# EAGLE design SEGmeter25 (EAGLE 6.2)
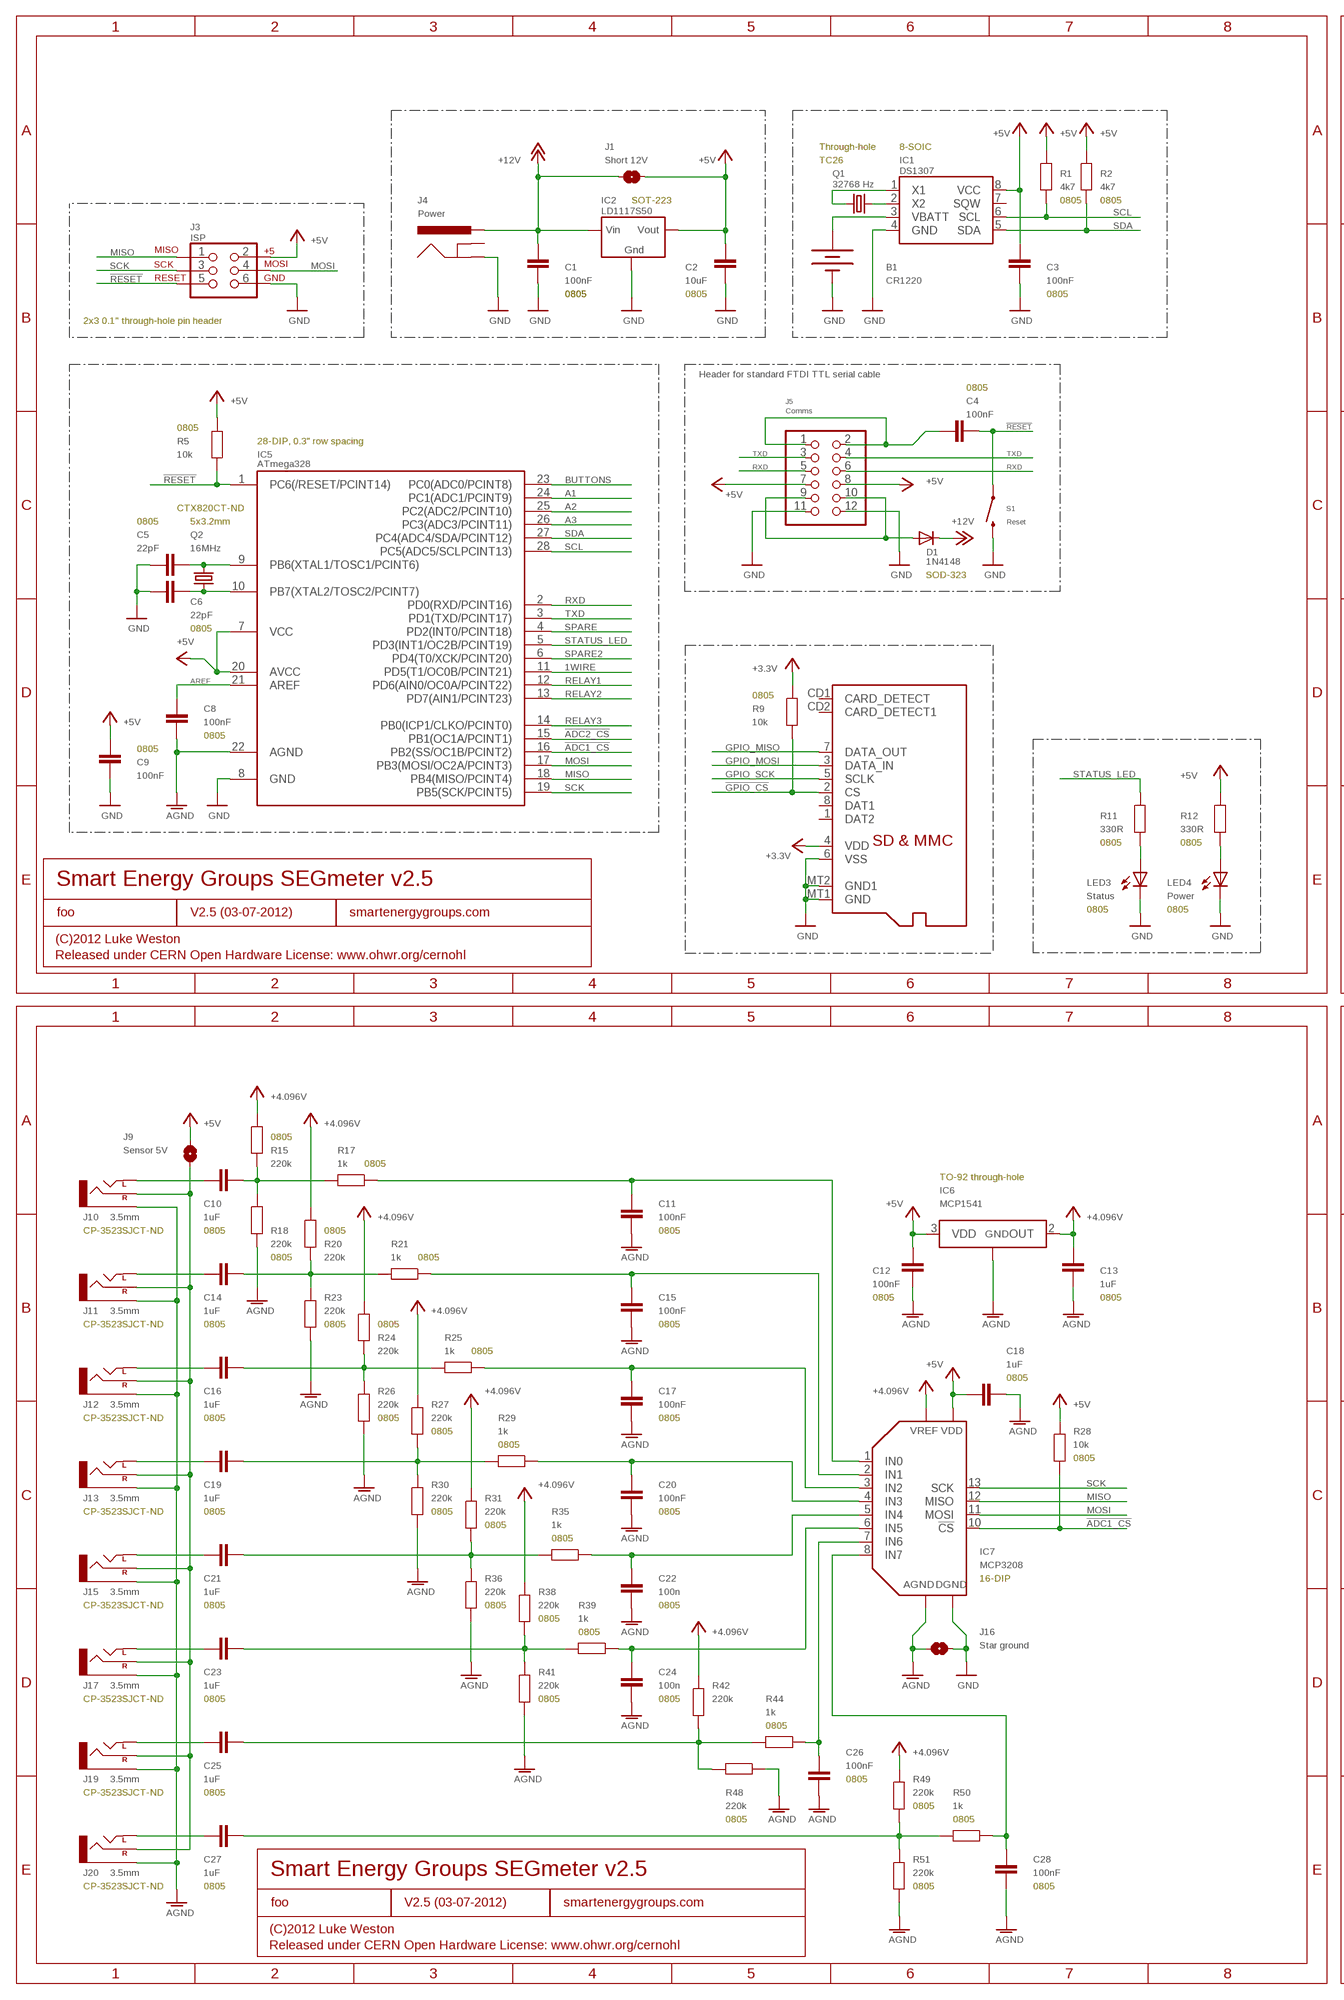
[diagram p0: schematic, sheet 1, part 1 of 2]
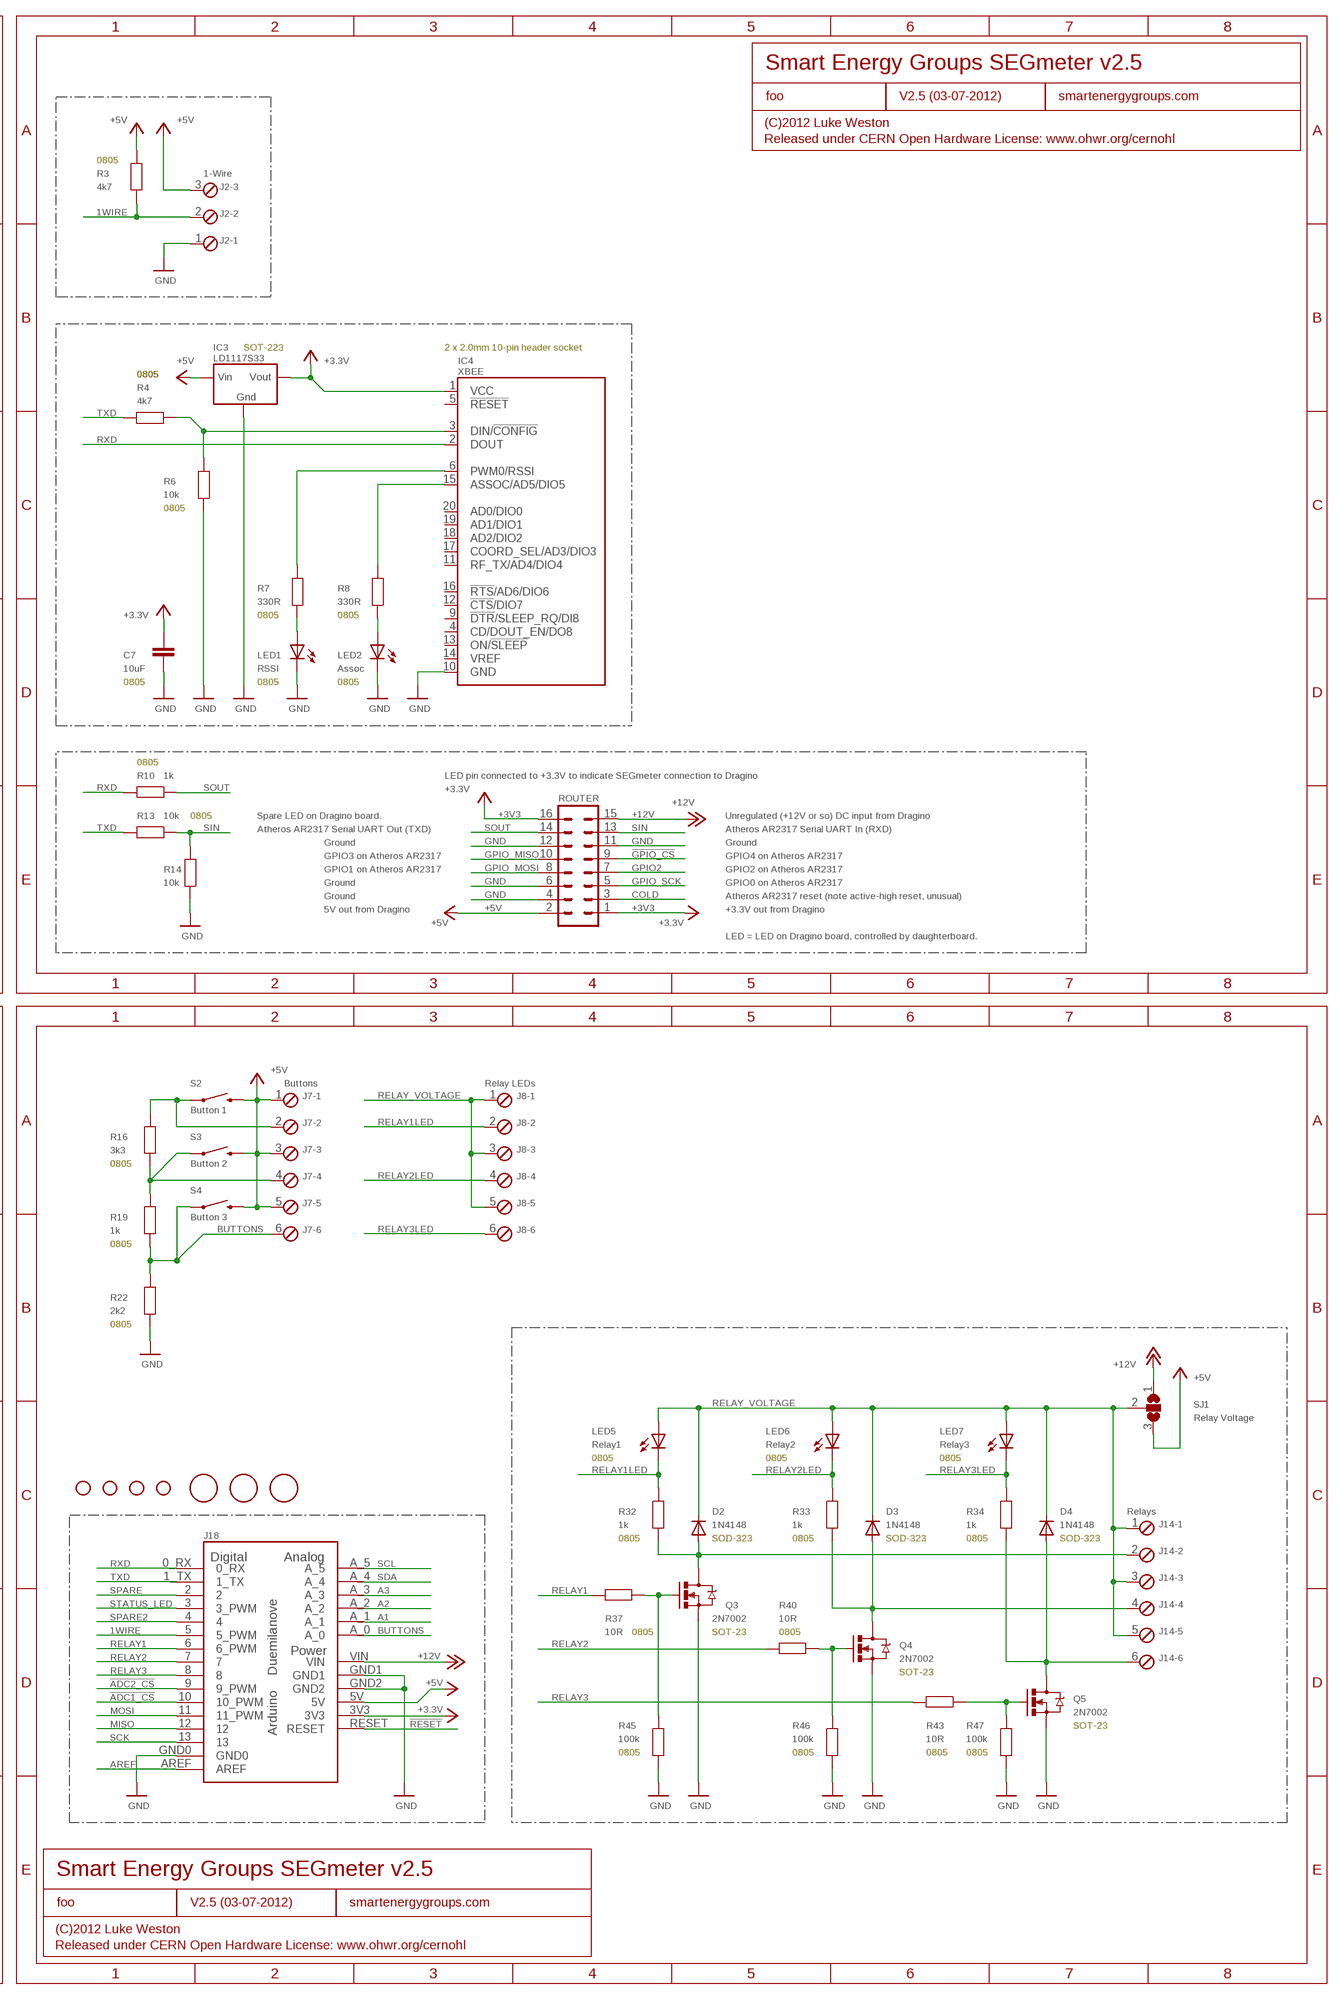
[diagram p1: schematic, sheet 1, part 2 of 2]

## Parts
B1  CR1220  BATTERY12MM  [BATTCON_12MM]
C1  100nF  CAP0805  [0805]
C2  10uF  CAP0805  [0805]
C3  100nF  CAP0805  [0805]
C4  100nF  CAP0805  [0805]
C5  22pF  CAP0805  [0805]
C6  22pF  CAP0805  [0805]
C7  10uF  CAP0805  [0805]
C8  100nF  CAP0805  [0805]
C9  100nF  CAP0805  [0805]
C10  1uF  CAP0805  [0805]
C11  100nF  CAP0805  [0805]
C12  100nF  CAP0805  [0805]
C13  1uF  CAP0805  [0805]
C14  1uF  CAP0805  [0805]
C15  100nF  CAP0805  [0805]
C16  1uF  CAP0805  [0805]
C17  100nF  CAP0805  [0805]
C18  1uF  CAP0805  [0805]
C19  1uF  CAP0805  [0805]
C20  100nF  CAP0805  [0805]
C21  1uF  CAP0805  [0805]
C22  100n  CAP0805  [0805]
C23  1uF  CAP0805  [0805]
C24  100n  CAP0805  [0805]
C25  1uF  CAP0805  [0805]
C26  100nF  CAP0805  [0805]
C27  1uF  CAP0805  [0805]
C28  100nF  CAP0805  [0805]
D1  1N4148  DIODESOD  [SOD-323]
D2  1N4148  DIODESOD  [SOD-323]
D3  1N4148  DIODESOD  [SOD-323]
D4  1N4148  DIODESOD  [SOD-323]
FID1  FIDUCIAL  [FIDUCIAL_1MM]
FID2  FIDUCIAL  [FIDUCIAL_1MM]
FID3  FIDUCIAL  [FIDUCIAL_1MM]
H1  STAND-OFF  [STAND-OFF]
H2  STAND-OFF  [STAND-OFF]
H3  STAND-OFF  [STAND-OFF]
H4  STAND-OFF  [STAND-OFF]
IC1  DS1307  DS1307SO8  [SO08]
IC2  LD1117S50  REG1117  [SOT223]
IC3  LD1117S33  REG1117  [SOT223]
IC4  XBEE  [XBEE-PRO]
IC5  ATmega328  MEGA48/88/168-PU  [DIL28-3]
IC6  MCP1541  [TO92-STRAIGHT]
IC7  MCP3208  MCP3208DIL  [DIL16]
J1  Short 12V  SJ  [SJ]
J2  1-Wire  MPT3  [3POL254]
J3  ISP  AVR_SPI_PRG_6NS  [2X3-NS]
J4  Power  POWER_JACKSLT  [POWER_JACK_SLOT]
J5  Comms  PINHD-2X6  [2X06]
J6  MICROSD  [MICROSD]
J7  Buttons  MPT6  [6POL254]
J8  Relay LEDs  MPT6  [6POL254]
J9  Sensor 5V  SJ  [SJ]
J10  3.5mm  AUDIO-JACKSMD2  [AUDIO-JACK-3.5MM-SMD]
J11  3.5mm  AUDIO-JACKSMD2  [AUDIO-JACK-3.5MM-SMD]
J12  3.5mm  AUDIO-JACKSMD2  [AUDIO-JACK-3.5MM-SMD]
J13  3.5mm  AUDIO-JACKSMD2  [AUDIO-JACK-3.5MM-SMD]
J14  Relays  MPT6  [6POL254]
J15  3.5mm  AUDIO-JACKSMD2  [AUDIO-JACK-3.5MM-SMD]
J16  Star ground  SJ  [SJ]
J17  3.5mm  AUDIO-JACKSMD2  [AUDIO-JACK-3.5MM-SMD]
J18  Arduino-compatible headers  ARDUINO-USBNO-OUTLINE-NO-TEXT-OCTAGONAL  [NO-OUTLINE-OCTAGONAL-NOTEXT]
J19  3.5mm  AUDIO-JACKSMD2  [AUDIO-JACK-3.5MM-SMD]
J20  3.5mm  AUDIO-JACKSMD2  [AUDIO-JACK-3.5MM-SMD]
LED1  RSSI  LED0805  [LED-0805]
LED2  Assoc  LED0805  [LED-0805]
LED3  Status  LED0805  [LED-0805]
LED4  Power  LED0805  [LED-0805]
LED5  Relay1  LED0805  [LED-0805]
LED6  Relay2  LED0805  [LED-0805]
LED7  Relay3  LED0805  [LED-0805]
Q1  32768 Hz  CRYSTAL32-SMD  [CRYSTAL-32KHZ-SMD]
Q2  16MHz  CRYSTAL5X3  [CRYSTAL-SMD-5X3]
Q3  2N7002  [SOT23-3]
Q4  2N7002  [SOT23-3]
Q5  2N7002  [SOT23-3]
R1  4k7  RESISTOR0805  [0805]
R2  4k7  RESISTOR0805  [0805]
R3  4k7  RESISTOR0805  [0805]
R4  4k7  RESISTOR0805  [0805]
R5  10k  RESISTOR0805  [0805]
R6  10k  RESISTOR0805  [0805]
R7  330R  RESISTOR0805  [0805]
R8  330R  RESISTOR0805  [0805]
R9  10k  RESISTOR0805  [0805]
R10  1k  RESISTOR0805  [0805]
R11  330R  RESISTOR0805  [0805]
R12  330R  RESISTOR0805  [0805]
R13  10k  RESISTOR0805  [0805]
R14  10k  RESISTOR0805  [0805]
R15  220k  RESISTOR0805  [0805]
R16  3k3  RESISTOR0805  [0805]
R17  1k  RESISTOR0805  [0805]
R18  220k  RESISTOR0805  [0805]
R19  1k  RESISTOR0805  [0805]
R20  220k  RESISTOR0805  [0805]
R21  1k  RESISTOR0805  [0805]
R22  2k2  RESISTOR0805  [0805]
R23  220k  RESISTOR0805  [0805]
R24  220k  RESISTOR0805  [0805]
R25  1k  RESISTOR0805  [0805]
R26  220k  RESISTOR0805  [0805]
R27  220k  RESISTOR0805  [0805]
R28  10k  RESISTOR0805  [0805]
R29  1k  RESISTOR0805  [0805]
R30  220k  RESISTOR0805  [0805]
R31  220k  RESISTOR0805  [0805]
R32  1k  RESISTOR0805  [0805]
R33  1k  RESISTOR0805  [0805]
R34  1k  RESISTOR0805  [0805]
R35  1k  RESISTOR0805  [0805]
R36  220k  RESISTOR0805  [0805]
R37  10R  RESISTOR0805  [0805]
R38  220k  RESISTOR0805  [0805]
R39  1k  RESISTOR0805  [0805]
R40  10R  RESISTOR0805  [0805]
R41  220k  RESISTOR0805  [0805]
R42  220k  RESISTOR0805  [0805]
R43  10R  RESISTOR0805  [0805]
R44  1k  RESISTOR0805  [0805]
R45  100k  RESISTOR0805  [0805]
R46  100k  RESISTOR0805  [0805]
R47  100k  RESISTOR0805  [0805]
R48  220k  RESISTOR0805  [0805]
R49  220k  RESISTOR0805  [0805]
R50  1k  RESISTOR0805  [0805]
R51  220k  RESISTOR0805  [0805]
ROUTER  MA08-2  [MA08-2]
S1  Reset  SWITCH-MOMENTARY-2SMD  [TACTILE_SWITCH_SMD]
S2  Button 1  SWITCH-MOMENTARY-2SMD  [TACTILE_SWITCH_SMD]
S3  Button 2  SWITCH-MOMENTARY-2SMD  [TACTILE_SWITCH_SMD]
S4  Button 3  SWITCH-MOMENTARY-2SMD  [TACTILE_SWITCH_SMD]
SJ1  Relay Voltage  SJ2W  [SJ_2]

## Nets
1WIRE: IC5.11(PD5(T1/OC0B/PCINT21)) J2.2 J18.5(5_PWM) R3.1
3.3VTXD: IC4.3(DIN/!CONFIG) R4.2 R6.1
!ADC1_CS: IC5.16(PB2(SS/OC1B/PCINT2)) IC7.10(!CS) J18.10(10_PWM) R28.1
!ADC2_CS: IC5.15(PB1(OC1A/PCINT1)) J18.9(9_PWM)
!GPIO_CS: J6.2(CS) R9.1 ROUTER.9
!RESET: C4.1 IC5.1(PC6(/RESET/PCINT14)) J3.5 J18.RESET R5.2 S1.1
+3V3: C7.2 IC3.2(VOUT) IC4.1(VCC) J6.4(VDD) J18.3V3 R9.2 ROUTER.1 ROUTER.16 ; supply symbol labelled +3.3V
+5V: C2.2 C3.2 C9.2 C12.2 C18.2 IC1.8(VCC) IC2.2(VOUT) IC3.3(VIN) IC5.7(VCC) IC5.20(AVCC) IC6.3(VDD) IC7.16(VDD) J1.2 J2.3 J3.2 J5.7 J5.8 J7.1 J7.3 J7.5 J9.2 J18.5V R1.2 R2.2 R3.2 R5.1 R12.2 R28.2 ROUTER.2 S2.3 S3.3 S4.3 SJ1.3
+12V: C1.2 D1.1(C) IC2.3(VIN) J1.1 J4.PWR J18.VIN ROUTER.15 SJ1.1
A1: IC5.24(PC1(ADC1/PCINT9)) J18.A_1
A2: IC5.25(PC2(ADC2/PCINT10)) J18.A_2
A3: IC5.26(PC3(ADC3/PCINT11)) J18.A_3
AGND: C8.1 C11.1 C12.1 C13.1 C15.1 C17.1 C18.1 C20.1 C22.1 C24.1 C26.1 C28.1 IC5.22(AGND) IC6.1(GND) IC7.14(AGND) J10.SLEEVE J11.SLEEVE J12.SLEEVE J13.SLEEVE J15.SLEEVE J16.2 J17.SLEEVE J19.SLEEVE J20.SLEEVE R18.1 R23.1 R26.1 R30.1 R36.1 R41.1 R48.1 R51.1
AREF: C8.2 IC5.21(AREF) J18.AREF
BUTTON1: J7.2 R16.2 S2.1
BUTTON2: J7.4 R16.1 R19.2 S3.1
BUTTONS: IC5.23(PC0(ADC0/PCINT8)) J7.6 J18.A_0 R19.1 R22.2 S4.1
COLD: ROUTER.3
GND: B1.GND(-) C1.1 C2.1 C3.1 C5.2 C6.2 C7.1 C9.1 IC1.4(GND) IC2.1(GND) IC3.1(GND) IC4.10(GND) IC5.8(GND) IC7.9(DGND) J2.1 J3.6 J4.GND J5.11 J5.12 J6.6(VSS) J6.MT1(GND) J6.MT2(GND1) J16.1 J18.GND0 J18.GND1 J18.GND2 LED1.C LED2.C LED3.C LED4.C Q3.2(S) Q4.2(S) Q5.2(S) R6.2 R14.2 R22.1 R45.1 R46.1 R47.1 ROUTER.4 ROUTER.6 ROUTER.11 ROUTER.12 S1.3
GPIO2: ROUTER.7
GPIO_MISO: J6.7(DATA_OUT) ROUTER.10
GPIO_MOSI: J6.3(DATA_IN) ROUTER.8
GPIO_SCK: J6.5(SCLK) ROUTER.5
MISO: IC5.18(PB4(MISO/PCINT4)) IC7.12(MISO) J3.1 J18.12
MOSI: IC5.17(PB3(MOSI/OC2A/PCINT3)) IC7.11(MOSI) J3.4 J18.11(11_PWM)
N$1: LED4.A R12.1
N$2: LED3.A R11.1
N$3: D1.2(A) J5.9 J5.10
N$4: IC4.6(PWM0/RSSI) R7.1
N$5: IC4.15(ASSOC/AD5/DIO5) R8.1
N$6: LED2.A R8.2
N$7: LED1.A R7.2
N$8: IC1.2(X2) Q1.X2
N$9: B1.PWR@1(+) IC1.3(VBATT)
N$12: IC1.1(X1) Q1.X1
N$18: D2.2(A) J14.2 Q3.3(D) R32.1
N$26: D3.2(A) J14.4 Q4.3(D) R33.1
N$28: C5.1 IC5.9(PB6(XTAL1/TOSC1/PCINT6)) Q2.1
N$29: C6.1 IC5.10(PB7(XTAL2/TOSC2/PCINT7)) Q2.3
N$30: C27.1 J20.TIP(LEFT)
N$40: D4.2(A) J14.6 Q5.3(D) R34.1
N$41: C25.1 J19.TIP(LEFT)
N$42: C10.1 J10.TIP(LEFT)
N$43: C4.2 J5.1 J5.2
N$44: C14.1 J11.TIP(LEFT)
N$45: C23.1 J17.TIP(LEFT)
N$46: J9.1 J10.RING(RIGHT) J11.RING(RIGHT) J12.RING(RIGHT) J13.RING(RIGHT) J15.RING(RIGHT) J17.RING(RIGHT) J19.RING(RIGHT) J20.RING(RIGHT)
N$47: C21.1 J15.TIP(LEFT)
N$48: C19.1 J13.TIP(LEFT)
N$49: C16.1 J12.TIP(LEFT)
N$50: C10.2 R15.1 R17.2 R18.2
N$51: C27.2 R49.1 R50.2 R51.2
N$52: C25.2 R42.1 R44.2 R48.2
N$53: C23.2 R38.1 R39.2 R41.2
N$54: C21.2 R31.1 R35.2 R36.2
N$55: C14.2 R20.1 R21.2 R23.2
N$56: C16.2 R24.1 R25.2 R26.2
N$57: C19.2 R27.1 R29.2 R30.2
N$59: C26.2 IC7.7(IN6) R44.1
N$60: C15.2 IC7.2(IN1) R21.1
N$62: C17.2 IC7.3(IN2) R25.1
N$63: C20.2 IC7.4(IN3) R29.1
N$64: C22.2 IC7.5(IN4) R35.1
N$65: C28.2 IC7.8(IN7) R50.1
N$66: Q5.1(G) R43.1 R47.2
N$67: C24.2 IC7.6(IN5) R39.1
N$68: Q3.1(G) R37.1 R45.2
N$69: Q4.1(G) R40.1 R46.2
N$70: C11.2 IC7.1(IN0) R17.1
RELAY1: IC5.12(PD6(AIN0/OC0A/PCINT22)) J18.6(6_PWM) R37.2
RELAY1LED: J8.2 LED5.C R32.2
RELAY2: IC5.13(PD7(AIN1/PCINT23)) J18.7 R40.2
RELAY2LED: J8.4 LED6.C R33.2
RELAY3: IC5.14(PB0(ICP1/CLKO/PCINT0)) J18.8 R43.2
RELAY3LED: J8.6 LED7.C R34.2
RELAY_VOLTAGE: D2.1(C) D3.1(C) D4.1(C) J8.1 J8.3 J8.5 J14.1 J14.3 J14.5 LED5.A LED6.A LED7.A SJ1.2
RXD: IC4.2(DOUT) IC5.2(PD0(RXD/PCINT16)) J5.5 J5.6 J18.0_RX R10.2
SCK: IC5.19(PB5(SCK/PCINT5)) IC7.13(SCK) J3.3 J18.13
SCL: IC1.6(SCL) IC5.28(PC5(ADC5/SCLPCINT13)) J18.A_5 R1.1
SDA: IC1.5(SDA) IC5.27(PC4(ADC4/SDA/PCINT12)) J18.A_4 R2.1
SIN: R13.1 R14.1 ROUTER.13
SOUT: R10.1 ROUTER.14
SPARE: IC5.4(PD2(INT0/PCINT18)) J18.2
SPARE2: IC5.6(PD4(T0/XCK/PCINT20)) J18.4
STATUS_LED: IC5.5(PD3(INT1/OC2B/PCINT19)) J18.3(3_PWM) R11.2
TXD: IC5.3(PD1(TXD/PCINT17)) J5.3 J5.4 J18.1_TX R4.1 R13.2
V+: C13.2 IC6.2(OUT) IC7.15(VREF) R15.2 R20.2 R24.2 R27.2 R31.2 R38.2 R42.2 R49.2 ; supply symbol labelled +4.096V
Unconnected: IC1.7(SQW) IC4.4(CD/DOUT_EN/DO8) IC4.5(!RESET) IC4.9(!DTR!/SLEEP_RQ/DI8) IC4.11(RF_TX/AD4/DIO4) IC4.12(!CTS!/DIO7) IC4.13(ON/!SLEEP) IC4.14(VREF) IC4.16(!RTS!/AD6/DIO6) IC4.17(COORD_SEL/AD3/DIO3) IC4.18(AD2/DIO2) IC4.19(AD1/DIO1) IC4.20(AD0/DIO0) J4.SW(GNDBREAK) J6.1(DAT2) J6.8(DAT1) J6.CD1(CARD_DETECT) J6.CD2(CARD_DETECT1)

## Notes on the sheet
- Smart Energy Groups SEGmeter v2.5
- foo | V2.5 (03-07-2012) | smartenergygroups.com
- (C)2012 Luke Weston
- Released under CERN Open Hardware License: www.ohwr.org/cernohl
- Through-hole | 8-SOIC
- TC26 | 0805
- SOT-223 | 0805 | 0805
- 0805 | 0805 | 0805 | 0805
- 2x3 0.1" through-hole pin header
- SOT-223 | 2 x 2.0mm 10-pin header socket
- Header for standard FTDI TTL serial cable | 0805 | 0805
- 0805
- 0805
- 28-DIP, 0.3" row spacing
- CTX820CT-ND | 0805
- 0805 | 5x3.2mm
- SOD-323
- 0805 | 0805
- 0805
- 0805 | 0805 | 0805
- 0805
- 0805
- 0805
- 0805
- LED pin connected to +3.3V to indicate SEGmeter connection to Dragino
- 0805 | Spare LED on Dragino board. | Unregulated (+12V or so) DC input from Dragino
- Atheros AR2317 Serial UART Out (TXD) | Atheros AR2317 Serial UART In (RXD)
- 0805 | 0805 | Ground | Ground
- GPIO3 on Atheros AR2317 | GPIO4 on Atheros AR2317
- GPIO1 on Atheros AR2317 | GPIO2 on Atheros AR2317
- Smart Energy Groups SEGmeter v2.5 | Ground | GPIO0 on Atheros AR2317
- Ground | Atheros AR2317 reset (note active-high reset, unusual)
- 0805 | 0805 | 5V out from Dragino | +3.3V out from Dragino
- foo | V2.5 (03-07-2012) | smartenergygroups.com
- LED = LED on Dragino board, controlled by daughterboard.
- (C)2012 Luke Weston
- Released under CERN Open Hardware License: www.ohwr.org/cernohl
- 0805
- 0805 | 0805
- TO-92 through-hole
- CP-3523SJCT-ND | 0805 | 0805 | 0805
- 0805
- 0805 | 0805
- 0805 | 0805
- CP-3523SJCT-ND | 0805 | 0805 | 0805 | 0805 | 0805
- 0805
- 0805
- CP-3523SJCT-ND | 0805 | 0805 | 0805
- 0805
- 0805
- 0805 | 0805 | 0805 | 0805
- CP-3523SJCT-ND | 0805 | 0805 | 0805
- 0805
- 0805 | 0805 | SOD-323 | 0805 | SOD-323 | 0805 | SOD-323
- 16-DIP
- CP-3523SJCT-ND | 0805 | 0805 | 0805
- 0805
- 0805 | 0805 | SOT-23 | 0805
- SOT-23
- CP-3523SJCT-ND | 0805 | 0805 | 0805
- 0805 | SOT-23
- 0805 | 0805 | 0805 | 0805
- 0805
- CP-3523SJCT-ND | 0805
- 0805
- 0805 | 0805
- Smart Energy Groups SEGmeter v2.5 | Smart Energy Groups SEGmeter v2.5
- CP-3523SJCT-ND | 0805 | 0805 | 0805
- foo | V2.5 (03-07-2012) | smartenergygroups.com | foo | V2.5 (03-07-2012) | smartenergygroups.com
- (C)2012 Luke Weston | (C)2012 Luke Weston
- Released under CERN Open Hardware License: www.ohwr.org/cernohl | Released under CERN Open Hardware License: www.ohwr.org/cernohl

## Library data of the parts
B1 = SparkFun:BATTERY: Battery Holders Various common sizes : AA, AAA, 20mm coin cell and 12mm coin cell.
C1-C28 = freetronics-master-v1:CAP: Capacitor Standard 0603 ceramic capacitor, and 0.1" leaded capacitor.
D1-D4 = SparkFun:DIODE: Diode These are standard reverse protection diodes and small signal diodes. SMA package can handle up to about 1A. SOD-323 can handle about 200mA. What the SOD-323 package when ordering, there are some mfgs out there that are 5-pin packages.
FID1-FID3 = adafruit:FIDUCIAL: For use by pick and place machines to calibrate the vision/machine, 1mm By microbuilder.eu
H1-H4 = SparkFun:STAND-OFF: Stand Off This is the mechanical footprint for a #4 phillips button head screw. Use the keepout ring to avoid running the screw head into surrounding components. SKU : PRT-00447
IC1 = SparkFun:DS1307
IC2 IC3 = burr-brown:REG1117: 800mA and 1A Low Dropout (LDO) Positive Regulator 1.8V, 2.5V, 2.85V, 3.3V, 5V, and Adj; MPN: REG1117; OC_FARNELL: 1097566; OC_NEWARK: 14P6981
IC4 = Luke:XBEE
IC5 = avr-5:MEGA48/88/168-PU
IC6 = freetronics-luke:MCP1541: Microchip MCP1541 4.096V voltage reference.
IC7 = Luke:MCP3208
J1 J9 J16 = freetronics-luke:SJ: PCB "solder jumper". Note that there should nothing on the BOM corresponding to this "component".
J2 = con-phoenix-254:MPT3: PHOENIX CONNECTOR; OC_FARNELL: unknown; OC_NEWARK: unknown
J3 = SparkFun:AVR_SPI_PRG_6: AVR ISP 6 Pin This is the reduced ISP connector for AVR programming. Common on Arduino. This footprint will take up less PCB space and can be used with a 10-pin to 6-pin adapter such as SKU: BOB-08508
J4 = SparkFun:POWER_JACK: Power Jack This is the standard 5.5mm barrel jack for power. The PTH is the most common, proven, reliable, footprint. All others are experimental. The Slot footprint only works if the mill layer is transmitted to the PCB fab house so be warned. Spark Fun Electronics SKU : PRT-00119. Mating wall wart : TOL-00298 (and others)
J5 = pinhead:PINHD-2X6: PIN HEADER
J6 = adafruit:MICROSD: Micro-SD / Transflash card holder with SPI pinout For the 3M # 2908-05WB-MG and/or 4UCON #19656 push-push type
J7 J8 J14 = con-phoenix-254:MPT6: PHOENIX CONNECTOR; OC_FARNELL: unknown; OC_NEWARK: unknown
J10-J13 J15 J17 J19 J20 = SparkFun:AUDIO-JACK: 3.5mm Audio Jack Simple 3.5mm common PCB mount audio jack. SKU: PRT-08032
J18 = Arduino-Various:ARDUINO-USB: The Ardiuno Duemilanove Pinouts layoutet as a Bare Shield. v0.5 Also for Arduino Diecimila. This is designed as a Part and has no Outline in the Dimension Layer. The Outline, when present, is drawed at the tPlace / bPlace Layer. Library by Stephanie Lange, http://www.k-ita.de/~sl/
LED1-LED7 = freetronics-master-v1:LED: LEDs Standard schematic elements and footprints for 5mm, 3mm, 1206, and 0603 sized LEDs. 5mm - Spark Fun Electronics SKU : COM-00529 (and others)
Q1 Q2 = SparkFun:CRYSTAL: Crystals Various standard crystals. Proven footprints. Spark Fun Electronics SKU : COM-00534
Q3-Q5 = freetronics-luke:2N7002: 2N7002 N-ch MOSFET in SOT-23.
R1-R51 = freetronics-master-v1:RESISTOR: Resistor Basic schematic elements and footprints for 0603, 1206, and PTH 1/10th watt (small) resistors.
ROUTER = con-lstb:MA08-2: PIN HEADER; OC_FARNELL: unknown; OC_NEWARK: unknown
S1-S4 = SparkFun:SWITCH-MOMENTARY-2
SJ1 = jumper:SJ2W: SMD solder JUMPER

## Board
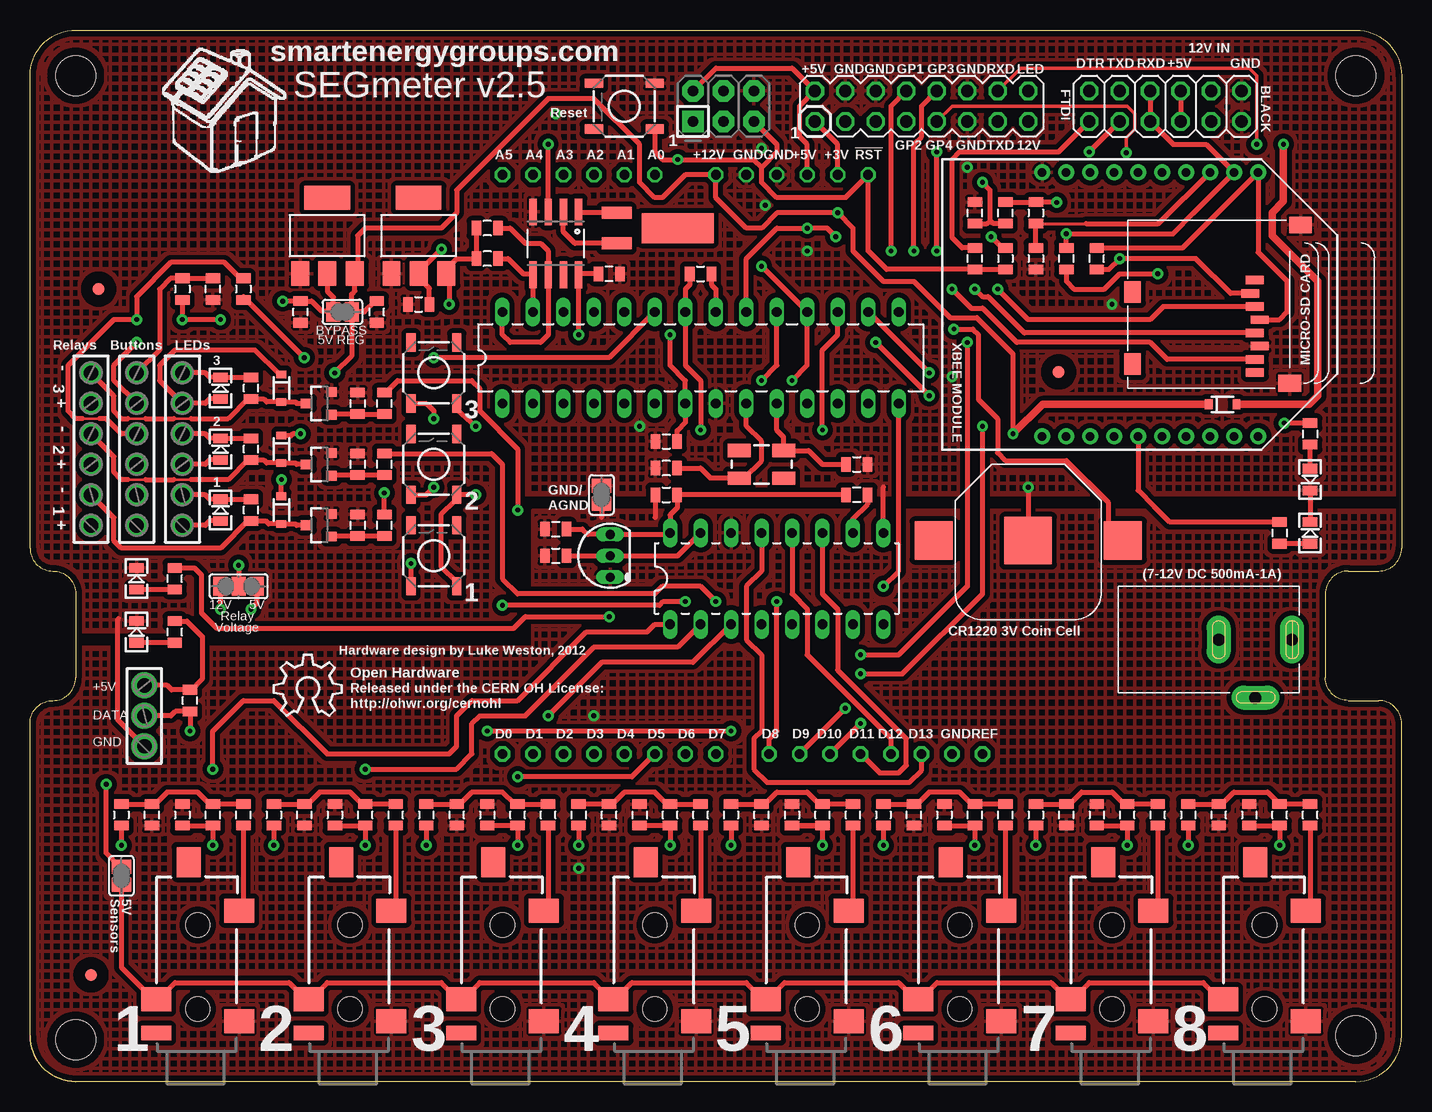
[diagram p2: board, top side]
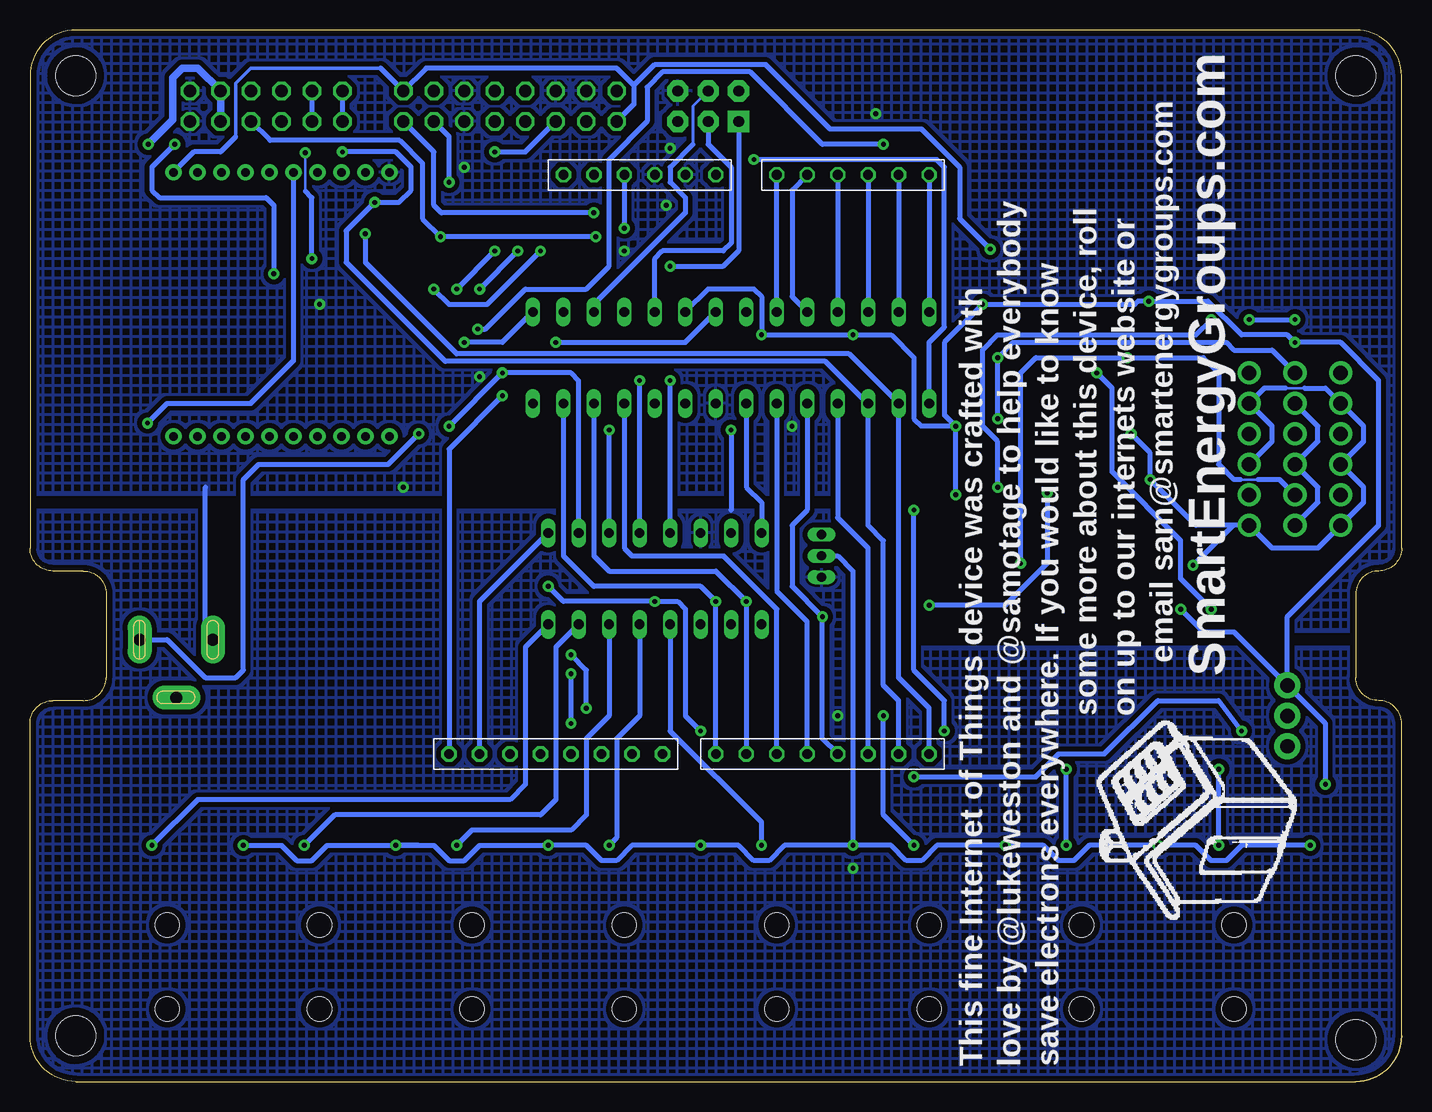
[diagram p3: board, bottom side, seen from below]

Size 114.3 x 87.63 mm. Coordinates in mm from the lower left corner, seen from the top.
Outline: 3.81,0 110.49,0 arc90 114.3,3.81 114.3,29.85 arc90 112.39,31.75 109.86,31.75 arc-90 107.95,33.66 107.95,40.64 arc-90 109.86,42.55 112.39,42.55 arc90 114.3,44.45 114.3,83.82 arc90 110.49,87.63 3.81,87.63 arc90 0,83.82 0,44.45 arc90 1.91,42.55 arc-90 3.81,40.64 3.81,33.66 arc-90 1.91,31.75 arc90 0,29.85 0,3.81
Outline: 3.81,0 arc-90 0,3.81
Outline: 0,3.81 arc90 3.81,0
Copper layers (1*16): Top 0.035mm / dielectric 1.5mm / Bottom 0.035mm
Design rules: minimum track width 8mil, minimum drill 0.4mm, track to track 8mil, track to pad 8mil, pad to pad 8mil, via to via 8mil, smd to smd 8mil, copper to edge 20mil, drill to drill 8mil, minimum pad ring 8mil, minimum via ring 10mil, stop-mask expansion 3mil, vias tented up to drill 25mil, thermal gap 8mil

### Footprints (pad centres in the part's own frame; a part is rotated, then mirrored left to right if it is on the bottom)
BATTCON_12MM = smd 3.962 x 3.962: GND 0,0 | smd 3.175 x 3.175: PWR@1 -7.874,0; PWR@2 7.874,0
0805 = smd 0.8 x 1.2: 1 -0.9,0; 2 0.9,0
SOD-323 = smd 0.63 x 0.83: 1 -1.15,0; 2 1.15,0
FIDUCIAL_1MM = smd 1 x 1: 1 0,0
STAND-OFF = hole 3.302: 0,0
SO08 = smd 0.61 x 2.21: 1 -1.905,-2.616; 2 -0.635,-2.616; 3 0.635,-2.616; 4 1.905,-2.616; 5 1.905,2.616; 6 0.635,2.616; 7 -0.635,2.616; 8 -1.905,2.616
SOT223 = smd 1.499 x 2.007: 1 -2.261,-3.15; 2 0.025,-3.15; 3 2.311,-3.15 | smd 3.81 x 2.007: 4 0,3.15
XBEE-PRO = drill 0.7 pad 1.346: 1 -11,10.27; 2 -11,8.27; 3 -11,6.27; 4 -11,4.27; 5 -11,2.27; 6 -11,0.27; 7 -11,-1.73; 8 -11,-3.73; 9 -11,-5.73; 10 -11,-7.73; 11 11,-7.73; 12 11,-5.73; 13 11,-3.73; 14 11,-1.73; 15 11,0.27; 16 11,2.27; 17 11,4.27; 18 11,6.27; 19 11,8.27; 20 11,10.27
DIL28-3 = drill 0.813 long: 1 -16.51,-3.81; 2 -13.97,-3.81; 3 -11.43,-3.81; 4 -8.89,-3.81; 5 -6.35,-3.81; 6 -3.81,-3.81; 7 -1.27,-3.81; 8 1.27,-3.81; 9 3.81,-3.81; 10 6.35,-3.81; 11 8.89,-3.81; 12 11.43,-3.81; 13 13.97,-3.81; 14 16.51,-3.81; 15 16.51,3.81; 16 13.97,3.81; 17 11.43,3.81; 18 8.89,3.81; 19 6.35,3.81; 20 3.81,3.81; 21 1.27,3.81; 22 -1.27,3.81; 23 -3.81,3.81; 24 -6.35,3.81; 25 -8.89,3.81; 26 -11.43,3.81; 27 -13.97,3.81; 28 -16.51,3.81
TO92-STRAIGHT = drill 0.762 pad 1.1 long: 1 -1.778,0; 2 0,0; 3 1.778,0
DIL16 = drill 0.813 long: 1 -8.89,-3.81; 2 -6.35,-3.81; 3 -3.81,-3.81; 4 -1.27,-3.81; 5 1.27,-3.81; 6 3.81,-3.81; 7 6.35,-3.81; 8 8.89,-3.81; 9 8.89,3.81; 10 6.35,3.81; 11 3.81,3.81; 12 1.27,3.81; 13 -1.27,3.81; 14 -3.81,3.81; 15 -6.35,3.81; 16 -8.89,3.81
SJ = smd 1.168 x 1.6: 1 -0.762,0; 2 0.762,0
3POL254 = drill 1.2 pad 2.184: 1 -2.54,0; 2 0,0; 3 2.54,0
2X3-NS = drill 0.9 pad 1.778 square: 1 -2.54,-1.27 | drill 0.9 pad 1.778 octagon: 2 -2.54,1.27; 3 0,-1.27; 4 0,1.27; 5 2.54,-1.27; 6 2.54,1.27
POWER_JACK_SLOT = drill 1 pad 2 long: GND 0,0; PWR 0,6.096; SW 4.826,3.048
2X06 = drill 1.016 octagon: 1 -6.35,-1.27; 2 -6.35,1.27; 3 -3.81,-1.27; 4 -3.81,1.27; 5 -1.27,-1.27; 6 -1.27,1.27; 7 1.27,-1.27; 8 1.27,1.27; 9 3.81,-1.27; 10 3.81,1.27; 11 6.35,-1.27; 12 6.35,1.27
MICROSD = smd 0.7 x 1.5: 1 9,-10.64; 2 7.9,-10.24; 3 6.8,-10.64; 4 5.7,-11.04; 5 4.6,-10.64; 6 3.5,-11.04; 7 2.4,-10.64; 8 1.3,-10.64 | smd 1.8 x 1.4: CD1 2,-0.44; CD2 8,-0.44 | smd 1.4 x 1.9: MT1 0.4,-13.54; MT2 13.6,-14.44
6POL254 = drill 1.2 pad 1.93: 1 -6.35,0; 2 -3.81,0; 3 -1.27,0; 4 1.27,0; 5 3.81,0; 6 6.35,0
AUDIO-JACK-3.5MM-SMD = smd 2 x 2.5: RING 4.3,3.45; SLEEVE 2.5,-3.45; TIP 11.7,-3.45 | smd 1.2 x 2.5: RSH 1.5,3.45 | smd 2.5 x 2: TSH 15.75,0.75 | hole 2: 3.5,0; 10.5,0
NO-OUTLINE-OCTAGONAL-NOTEXT = drill 0.8 pad 1.27 octagon: 0_RX -25.4,27.94; 1_TX -25.4,25.4; 2 -25.4,22.86; 3 -25.4,20.32; 3V3 22.86,0; 4 -25.4,17.78; 5 -25.4,15.24; 5V 22.86,2.54; 6 -25.4,12.7; 7 -25.4,10.16; 8 -25.4,5.715; 9 -25.4,3.175; 10 -25.4,0.635; 11 -25.4,-1.905; 12 -25.4,-4.445; 13 -25.4,-6.985; A_0 22.86,15.24; A_1 22.86,17.78; A_2 22.86,20.32; A_3 22.86,22.86; A_4 22.86,25.4; A_5 22.86,27.94; AREF -25.4,-12.065; GND0 -25.4,-9.525; GND1 22.86,7.62; GND2 22.86,5.08; RESET 22.86,-2.54; VIN 22.86,10.16
LED-0805 = smd 0.8 x 1.2: A -0.9,0; C 0.9,0
CRYSTAL-32KHZ-SMD = smd 2.5 x 6: SHEILD 0,5.08 | smd 1 x 2.5: X1 -1.27,0; X2 1.27,0
CRYSTAL-SMD-5X3 = smd 1.9 x 1.1: 1 -1.85,-1.15; 2 1.85,-1.15; 3 1.85,1.15; 4 -1.85,1.15
SOT23-3 = smd 0.8 x 0.9: 1 -0.95,-1; 2 0.95,-1; 3 0,1.1
MA08-2 = drill 1.016 octagon: 1 -8.89,-1.27; 2 -8.89,1.27; 3 -6.35,-1.27; 4 -6.35,1.27; 5 -3.81,-1.27; 6 -3.81,1.27; 7 -1.27,-1.27; 8 -1.27,1.27; 9 1.27,-1.27; 10 1.27,1.27; 11 3.81,-1.27; 12 3.81,1.27; 13 6.35,-1.27; 14 6.35,1.27; 15 8.89,-1.27; 16 8.89,1.27
TACTILE_SWITCH_SMD = smd 1.524 x 0.762: 1 -2.54,1.905; 2 2.54,1.905; 3 -2.54,-1.905; 4 2.54,-1.905
SJ_2 = smd 1.168 x 1.6: 1 -1.524,0; 2 0,0; 3 1.524,0

### Placement (x,y rotation side)
B1  83.19,45.09 180 top
C1  28.89,64.13 90 top
C2  22.54,64.13 90 top
C3  48.26,67.31 180 top
C4  78.74,68.58 90 top
C5  53.02,51.12 180 top
C6  68.9,51.44 0 top
C7  32.38,64.77 0 top
C8  55.88,67.31 0 top
C9  53.02,53.34 0 top
C10  17.78,22.23 90 top
C11  12.7,22.23 270 top
C12  43.81,46.04 0 top
C13  43.81,43.81 0 top
C14  30.48,22.23 90 top
C15  25.4,22.23 270 top
C16  43.18,22.23 90 top
C17  38.1,22.23 270 top
C18  53.02,48.9 0 top
C19  55.88,22.23 90 top
C20  50.8,22.23 270 top
C21  68.58,22.23 90 top
C22  63.5,22.23 270 top
C23  81.28,22.23 90 top
C24  76.2,22.23 270 top
C25  93.98,22.23 90 top
C26  88.9,22.23 270 top
C27  106.68,22.23 90 top
C28  101.6,22.23 270 top
D1  99.38,56.44 0 top
D2  20.95,47.62 270 top
D3  20.95,52.7 270 top
D4  20.95,57.79 270 top
FID1  85.72,59.13 0 top
FID2  5.08,8.89 0 top
FID3  5.71,66.04 0 top
H1  3.81,3.49 0 top
H2  3.81,83.82 0 top
H3  110.49,83.82 0 top
H4  110.49,3.81 180 top
IC1  43.81,69.85 180 top
IC2  24.77,70.48 0 top
IC3  32.38,70.48 0 top
IC4  92.08,64.77 270 top
IC5  55.88,60.33 0 top
IC6  48.34,43.81 90 top
IC7  62.23,41.91 0 top
J1  26.03,64.13 180 top
J2  9.53,30.48 90 top
J3  57.78,81.28 0 top
J4  99.06,36.83 270 top
J5  94.61,81.28 0 top
J6  91.44,57.79 90 top
J7  8.89,52.7 90 top
J8  12.7,52.7 90 top
J9  7.62,17.14 90 top
J10  13.97,2.54 90 top
J11  26.67,2.54 90 top
J12  39.37,2.54 90 top
J13  52.07,2.54 90 top
J14  5.08,52.7 90 top
J15  64.77,2.54 90 top
J16  47.62,48.9 270 top
J17  77.47,2.54 90 top
J18  67.31,52.7 90 top
J19  90.17,2.54 90 top
J20  102.87,2.54 90 top
LED1  106.68,50.16 270 top
LED2  106.68,45.72 90 top
LED3  8.89,41.91 90 top
LED4  8.89,37.47 90 top
LED5  15.88,47.62 90 top
LED6  15.88,52.7 90 top
LED7  15.88,57.79 90 top
Q1  48.89,71.12 270 top
Q2  60.96,51.44 0 top
Q3  24.13,46.36 90 top
Q4  24.13,51.44 90 top
Q5  24.13,56.52 90 top
R1  38.1,71.12 180 top
R2  38.1,68.58 180 top
R3  13.34,31.75 90 top
R4  83.82,72.39 270 top
R5  81.28,68.58 270 top
R6  83.82,68.58 270 top
R7  106.68,53.98 270 top
R8  104.14,45.72 270 top
R9  88.9,68.58 90 top
R10  86.36,68.58 90 top
R11  12.07,41.91 90 top
R12  12.07,37.47 90 top
R13  81.28,72.39 90 top
R14  78.74,72.39 90 top
R15  7.62,22.23 270 top
R16  17.78,66.04 270 top
R17  15.24,22.23 90 top
R18  10.16,22.23 90 top
R19  12.7,66.04 270 top
R20  20.32,22.23 270 top
R21  27.94,22.23 90 top
R22  15.24,66.04 90 top
R23  22.86,22.23 90 top
R24  33.02,22.23 270 top
R25  40.64,22.23 90 top
R26  35.56,22.23 90 top
R27  45.72,22.23 270 top
R28  68.9,48.9 180 top
R29  53.34,22.23 90 top
R30  48.26,22.23 90 top
R31  58.42,22.23 270 top
R32  18.41,47.62 90 top
R33  18.41,52.7 90 top
R34  18.41,57.79 90 top
R35  66.04,22.23 90 top
R36  60.96,22.23 90 top
R37  29.53,46.36 90 top
R38  71.12,22.23 270 top
R39  78.74,22.23 90 top
R40  29.53,51.44 90 top
R41  73.66,22.23 90 top
R42  83.82,22.23 270 top
R43  29.53,56.52 90 top
R44  91.44,22.23 90 top
R45  27.3,46.36 270 top
R46  27.3,51.44 270 top
R47  27.3,56.52 270 top
R48  86.36,22.23 90 top
R49  96.52,22.23 270 top
R50  104.14,22.23 90 top
R51  99.06,22.23 90 top
ROUTER  74.3,81.28 0 top
S1  49.53,81.28 180 top
S2  33.66,43.81 90 top
S3  33.66,51.44 90 top
S4  33.66,59.05 90 top
SJ1  17.38,41.27 0 top
U$1  [OSHW_8X200_NOTEXT]  20.32,30.48 0 top

### Tracks (layer width: path | path; a pad name or v marks a point on that pad's centre or on a via)
1WIRE  (via drill 0.4)
  Top 0.406: J18.5 50.16,25.4 v40.64,25.4 | J2.2 11.75,30.48 12.12,30.85 R3.1 v13.34,29.21
  Bottom 0.406: IC5.11 64.77,44.45 64.14,43.81 56.52,43.81 52.07,39.37 J18.5 | v13.34,29.21 15.24,31.75 20.32,31.75 24.77,27.3 28.58,27.3 30.48,25.4 v40.64,25.4
3.3VTXD
  Top 0.254: R4.2 88,71.49
  Top 0.406: R6.1 R4.2 | IC4.3 96.23,73.66 96.2,73.66 94.77,72.23 94.03,71.49 88,71.49
!ADC1_CS  (via drill 0.4)
  Top 0.406: J18.10 v69.22,29.85 | v69.22,33.97 72.71,33.97 79.38,40.64 v79.38,54.61 | v74.93,59.05 IC5.16 | IC7.10 68.58,46.91 69.8,48.13 R28.1
  Bottom 0.406: v69.22,29.85 v69.22,33.97 | v79.38,54.61 v74.93,59.05 69.22,59.05 68.58,58.42 IC7.10
!ADC2_CS  (via drill 0.4)
  Top 0.406: v78.11,61.59 78.11,41.27 72.39,35.56 v69.22,35.56 | J18.9 v67.95,31.12
  Bottom 0.406: IC5.15 74.93,61.59 v78.11,61.59 | v67.95,31.12 67.95,34.29 v69.22,35.56
!GPIO_CS  (via drill 0.4)
  Top 0.305: v91.36,77.39 91.36,78.66 92.08,79.38 92.08,80.64 91.44,81.28 76.83,81.28 ROUTER.9
  Top 0.406: J6.2 100.05,65.69 97.16,68.58 v90.8,68.58 89.91,67.68 R9.1
  Bottom 0.203: 91.36,74.22 v91.36,77.39
  Bottom 0.406: v90.8,68.58 90.8,73.66 91.36,74.22
!RESET  (via drill 0.4)
  Top 0.406: R5.2 C4.1 71.39,67.68 69.85,69.22 J18.RESET 67.95,73.66 62.23,73.66 60.96,74.93 60.96,76.2 | J3.5 62.23,78.11 62.23,77.47 60.96,76.2 | 60.96,76.2 60.32,76.84 v53.98,76.84 52.7,76.84 52.07,77.47 S1.1
  Bottom 0.406: IC5.1 39.37,61.59 38.1,62.87 38.1,76.2 38.73,76.84 v53.98,76.84
+3V3  (via drill 0.4)
  Top 0.406: R9.2 96.05,69.48 IC4.1 102.34,69.11 104.77,66.67 104.77,64.13 104.12,63.48 J6.4 | J18.3V3 67.31,78.11 ROUTER.1 | v34.29,69.37 32.94,68.02 32.78,68.02 32.78,67.71 IC3.2 32.38,67.31 32.38,66.99 33.28,66.09 C7.2
  Bottom 0.305: 85.09,84.45 95.89,84.45 97.16,83.19 97.16,78.74
  Bottom 0.406: 63.98,83.03 62.23,84.77 53.02,84.77 47.62,79.38 40,79.38 36.83,76.2 36.83,71.91 v34.29,69.37 | 63.98,83.03 65.41,84.45 81.28,84.45 ROUTER.16 85.09,84.45 | 63.98,83.03 63.98,81.44 ROUTER.1 | 97.16,78.74 98.42,77.47 100.64,77.47 IC4.1
+5V  (via drill 0.4)
  Top 0.406: R1.2 R2.2 35.56,68.58 34.92,67.95 34.92,67.11 | J3.2 57.15,84.45 63.5,84.45 ROUTER.2 64.14,81.28 64.14,78.74 64.77,78.11 J18.5V | v53.34,62.23 53.34,59.69 54.61,58.42 IC5.7 54.61,54.93 53.92,54.24 C9.2 | R12.2 13.07,38.37 14.37,37.07 14.37,33.58 13.34,32.54 R3.2 11.8,32.65 11.43,33.02 J2.3 | SJ1.3 18.91,39.86 v18.41,39.37 | IC2.2 24.79,65.86 25.27,65.37 J1.2 25.19,64.21 24.29,64.21 23.47,65.03 C2.2 v21.06,65.03 | C12.2 46.04,46.04 46.48,45.59 IC6.3 53.21,45.59 IC7.16 53.34,47.23 53.92,47.81 C18.2 R28.2 | J5.8 J5.7 | J9.2 7.49,17.91 6.35,19.05 v6.35,24.77 | 34.92,67.11 IC3.3 | v45.72,62.23 IC1.8 45.8,67.31 C3.2 | IC5.20 59.69,68.58 62.23,71.12 v64.77,71.12 66.44,71.12 v67.15,70.41 | R5.1 81.02,69.48 v80.09,70.41 | 34.92,67.11 v34.92,64.77 | J7.5 6.99,58.42 6.99,59.69 v8.89,61.59 | S2.3 35.56,41.59 34.29,42.86 34.29,47.31 35.4,48.42 35.4,48.74 S3.3 v37.15,48.9 | S4.3 35.56,56.04 v37.15,54.61
  Bottom 0.406: J18.5V v64.77,71.12 | v6.35,24.77 6.35,29.85 J2.3 | v18.41,39.37 16.51,37.47 13.97,37.47 J2.3 | IC5.7 54.61,49.53 53.34,48.26 IC7.16 | IC5.20 57.78,66.04 53.98,66.04 53.34,65.41 v53.34,62.23 v45.72,62.23 42.55,62.23 40.64,60.33 40.64,55.25 40,54.61 v37.15,54.61 | v67.15,70.41 v80.09,70.41 81.6,71.91 81.6,76.52 83.5,78.42 94.3,78.42 J5.7 | J7.1 6.99,48.26 6.99,49.53 J7.3 6.99,53.34 6.99,54.61 J7.5 | J2.3 9.53,38.73 1.91,46.36 1.91,58.42 5.08,61.59 v8.89,61.59 9.53,62.23 13.34,62.23 16.14,65.03 v21.06,65.03 21.96,65.03 22.23,64.77 v34.92,64.77 38.1,61.59 38.1,55.56 v37.15,54.61 | v37.15,48.9 v37.15,54.61
+12V  (via drill 0.4)
  Top 0.406: SJ1.1 15.86,39.39 v15.88,39.37 | 27.07,67.34 IC2.3 | J1.1 26.8,65.61 27.08,65.89 IC2.3 | C1.2 28.76,65.03 27.86,64.13 J1.1 | J1.1 26.8,60.45 v25.4,59.05 | IC2.3 27.3,67.56 27.3,70.48 27.94,71.12 34.29,71.12 35.56,72.39 35.56,74.3 43.18,81.92 46.99,81.92 50.8,78.11 50.8,74.93 52.07,73.66 52.7,73.66 54.61,75.56 J18.VIN 57.15,73.66 59.69,71.12 60.96,71.12 62.23,72.39 v67.31,72.39 68.58,71.12 68.58,69.22 71.12,66.67 73.66,66.67 76.68,63.66 78.9,63.66 81.91,60.64 v81.91,53.98
  Top 0.61: D1.1 84.38,56.44 v81.91,53.98
  Bottom 0.406: v67.31,72.39 80.01,72.39 80.64,73.03 80.64,77.47 ROUTER.15 | v15.88,39.37 18.41,41.91 18.41,45.09 24.13,50.8 24.13,57.79 v25.4,59.05 | v81.91,53.98 84.45,51.44 95.25,51.44 96.52,50.16 96.52,34.29 97.16,33.66 99.69,33.66 102.87,36.83 J4.PWR
A1
  Bottom 0.406: J18.A_1 50.8,74.3 50.8,65.41 IC5.24
A2
  Bottom 0.406: J18.A_2 IC5.25
A3
  Bottom 0.406: J18.A_3 IC5.26
AGND  (via drill 0.4)
  Top 0.406: v55.88,54.29 55.88,58.42 54.61,59.69 IC5.22 54.61,66.04 54.98,66.41 C8.1 | C18.1 52.12,47.04 52.07,46.99 | 47.62,49.53 47.62,46.99
  Bottom 0.406: v55.88,54.29 55.88,47.62
  other vias: 46.99,30.48 45.72,17.78
  pour Bottom (isolate 0.406, hatched): -1.27,36.2 43.18,36.2 43.18,47.62 115.57,47.62 115.57,-0.64 -1.27,-0.64
  pour Top (isolate 0.406, hatched): -1.27,36.2 41.91,36.2 41.91,47.62 115.57,47.62 115.57,-0.64 -1.27,-0.64
AREF  (via drill 0.4)
  Top 0.406: v70.48,61.59 v74.93,57.15 | C8.2 56.78,66.41 57.15,66.04 IC5.21
  Bottom 0.406: v70.48,61.59 59.69,61.59 IC5.21 | v74.93,57.15 79.38,52.7 J18.AREF
BUTTON1  (via drill 0.4)
  Top 0.406: R16.2 17.78,65.41 v22.86,60.33 | S2.1 v31.75,43.18
  Bottom 0.203: 11.99,50.16 13.41,50.16
  Bottom 0.406: v31.75,43.18 31.75,59.05 30.48,60.33 v22.86,60.33 16.51,60.33 15.24,59.05 15.24,51.44 13.97,50.16 13.41,50.16 | J7.2 10.16,50.16 11.99,50.16
BUTTON2  (via drill 0.4)
  Top 0.203: 5.79,55.25 4.37,55.25
  Top 0.406: J7.4 7.62,53.98 6.35,55.25 5.79,55.25 | R19.2 v12.7,63.5 v15.88,63.5 | R16.1 17.52,66.94 16.19,68.26 11.75,68.26 8.89,65.41 v8.89,63.5 6.99,63.5 3.17,59.69 3.17,55.88 3.81,55.25 4.37,55.25 | S3.1 33.02,48.9 v33.66,49.53
  Bottom 0.406: v12.7,63.5 v8.89,63.5 | v33.66,49.53 33.66,53.34 34.92,54.61 34.92,60.96 33.66,62.23 17.14,62.23 v15.88,63.5
BUTTONS  (via drill 0.4)
  Top 0.406: IC5.23 48.26,60.33 v33.66,60.33 | J7.6 10.79,60.96 10.79,66.04 11.7,66.94 R19.1 R22.2 | S4.1 33.02,56.52 33.66,55.88 v33.66,55.25
  Bottom 0.406: IC5.23 J18.A_0 | J7.6 10.79,60.96 13.97,60.96 14.61,61.59 32.38,61.59 v33.66,60.33 v33.66,55.25
GND  (via drill 0.4)
  Top 0.406: IC7.9 71.12,49.53 | J2.1 7.3,30.16 7.3,38.5 7.38,38.58 | v83.19,49.53 B1.GND | LED1.C LED2.C
  Bottom 0.406: J18.GND0 76.83,40.01 IC7.9 | J4.GND 99.69,36.83 99.69,49.53
  other vias: 50.8,54.61 43.81,80.64 61.28,73.03 60.96,77.79 64.77,69.22 78.11,76.2 90.17,64.77 76.83,58.74
  pour Bottom (isolate 0.406, hatched): -1.27,37.47 41.27,37.47 41.27,48.9 115.57,48.9 115.57,88.9 -1.32,88.93
  pour Top (isolate 0.406, hatched): -1.27,88.9 115.57,88.9 115.57,48.9 40.64,48.9 40.64,37.47 -1.27,37.47
GPIO_MISO  (via drill 0.4)
  Top 0.406: J6.7 94.75,60.19 93.34,61.59 82.23,61.59 79.38,64.45 78.42,64.45 v76.83,66.04 | v73.66,69.22 73.66,78.11 74.3,78.74 74.3,81.28 ROUTER.10
  Bottom 0.406: v76.83,66.04 v73.66,69.22
GPIO_MOSI  (via drill 0.4)
  Top 0.406: J6.3 94.43,64.58 93.34,63.5 83.19,63.5 v80.64,66.04 | v71.75,69.22 71.75,81.28 ROUTER.8
  Bottom 0.406: v80.64,66.04 79.38,64.77 76.2,64.77 v71.75,69.22
GPIO_SCK  (via drill 0.4)
  Top 0.406: J6.5 82.87,62.38 79.85,65.41 79.38,65.41 v78.74,66.04 | v75.56,69.22 v75.56,77.47
  Bottom 0.406: v78.74,66.04 v75.56,69.22 | v75.56,77.47 73.02,77.47 ROUTER.5
MISO  (via drill 0.4)
  Top 0.406: v60.96,67.95 IC5.18 64.77,59.69 v63.5,58.42 | IC7.12 63.5,40.64 64.77,39.37 64.77,35.56 71.75,28.58 J18.12
  Bottom 0.406: J3.1 55.24,69.22 56.52,67.95 v60.96,67.95 | IC7.12 v63.5,58.42
MOSI  (via drill 0.4)
  Top 0.406: IC5.17 67.31,62.23 66.04,60.96 v66.04,54.29 | IC7.11 66.04,40.64 67.31,39.37 67.31,34.29 73.02,28.58 73.02,26.35 72.39,25.72 70.8,25.72 J18.11
  Bottom 0.254: J3.4 59.05,81.28 59.05,78.11
  Bottom 0.406: 59.05,78.11 60.96,76.2 60.96,74.93 59.69,73.66 59.69,72.39 67.31,64.77 IC5.17 | IC7.11 v66.04,54.29
N$1
  Top 0.406: R12.1 LED4.A
N$2
  Top 0.406: LED3.A R11.1
N$3  (via drill 0.4)
  Top 0.61: D1.2 106.6,56.44 107.31,57.15 107.31,66.67 103.5,70.48 103.5,72.39 104.46,73.34 v104.46,78.11
  Bottom 0.61: J5.9 J5.10 100.33,84.45 101.6,84.45 102.39,83.66 102.39,80.17 v104.46,78.11
N$4  (via drill 0.4)
  Top 0.406: R7.1 v104.51,54.88
  Bottom 0.406: v104.51,54.88 102.87,56.52 95.89,56.52 92.34,60.05 IC4.6
N$5
  Top 0.406: IC4.15 92.34,49.26 93.66,47.94 93.98,47.62 94.98,46.62 R8.1
N$6
  Top 0.406: LED2.A R8.2
N$7
  Top 0.406: LED1.A R7.2
N$8
  Top 0.406: IC1.2 44.45,70.8 44.93,70.33 45.09,70.17 45.4,69.85 Q1.X2
N$9  (via drill 0.4)
  Top 0.406: IC1.3 v43.18,78.11 | 91.12,45.09 B1.PWR@1 90.17,45.09 89.85,45.4 89.85,48.26 86.36,51.75 81.28,51.75 80.64,52.39 80.64,55.25 79.06,56.83 79.06,62.23 78.58,62.71 v76.99,62.71
  Bottom 0.406: v43.18,78.11 48.26,78.11 54.29,84.14 61.59,84.14 62.86,82.87 62.86,80.01 66.04,76.84 66.04,67.95 67.95,66.04 73.02,66.04 76.36,62.71 v76.99,62.71
N$12
  Top 0.406: 45.8,72.39 IC1.1 | 45.72,72.71 IC1.1 | Q1.X1 45.72,72.39 IC1.1
N$18
  Top 0.406: J14.2 6.99,46.99 6.99,45.09 7.62,44.45 15.88,44.45 18.15,46.73 R32.1 19.63,46.73 19.88,46.48 D2.2 22.1,46.48 22.23,46.36 Q3.3
N$26
  Top 0.203: 13.41,50.16 11.99,50.16 | 9.6,50.16 8.18,50.16
  Top 0.406: J14.4 6.99,52.07 6.99,50.8 7.62,50.16 8.18,50.16 | Q4.3 22.23,51.44 22.1,51.55 D3.2 19.72,51.55 19.47,51.8 R33.1 18.15,51.8 16.51,50.16 13.41,50.16 | 9.6,50.16 11.99,50.16
N$28
  Top 0.406: C5.1 55.88,51.12 56.71,50.29 Q2.1 59.49,50.29 60.96,51.75 60.96,53.34 59.69,54.61 IC5.9
N$29
  Top 0.406: C6.1 66.04,51.44 64.89,52.59 Q2.3 62.81,53.71 62.23,54.29 IC5.10
N$30
  Top 0.406: C27.1 106.68,14.6 J20.TIP
N$40
  Top 0.203: 8.18,55.25 9.6,55.25 | 11.99,55.25 13.41,55.25
  Top 0.406: J14.6 6.99,57.15 6.99,55.88 7.62,55.25 8.18,55.25 | Q5.3 22.23,56.52 22.1,56.63 D4.2 19.72,56.63 19.47,56.88 R34.1 18.15,56.88 16.51,55.25 13.41,55.25 | 9.6,55.25 11.99,55.25
N$41
  Top 0.406: C25.1 93.98,14.6 J19.TIP
N$42
  Top 0.406: C10.1 17.78,14.6 J10.TIP
N$43
  Top 0.406: J5.1 85.72,77.47 77.47,77.47 76.83,76.84 76.83,70.33 77.68,69.48 C4.2
  Bottom 0.406: J5.2 J5.1
N$44
  Top 0.406: C14.1 30.48,14.6 J11.TIP
N$45
  Top 0.406: C23.1 81.28,14.6 J17.TIP
N$46
  Top 0.406: J20.RING 99.27,6.99 99.06,6.99 97.79,8.25 88.27,8.25 86.85,6.84 J19.RING 86.58,6.99 86.36,6.99 85.09,8.25 75.56,8.25 74.15,6.84 J17.RING 73.88,6.99 73.66,6.99 72.39,8.25 62.86,8.25 61.45,6.84 J15.RING 61.17,6.99 60.96,6.99 59.69,8.25 50.16,8.25 48.75,6.84 J13.RING 48.48,6.99 48.26,6.99 46.99,8.25 37.46,8.25 36.05,6.84 J12.RING 35.77,6.99 35.56,6.99 34.29,8.25 24.77,8.25 23.35,6.84 J11.RING 23.08,6.99 22.86,6.99 21.59,8.25 12.07,8.25 10.65,6.84 J10.RING 10.38,6.99 10.16,6.99 7.62,9.53 J9.1
N$47
  Top 0.406: C21.1 68.58,14.6 J15.TIP
N$48
  Top 0.406: C19.1 55.88,14.6 J13.TIP
N$49
  Top 0.406: C16.1 43.18,14.6 J12.TIP
N$50
  Top 0.406: 15.24,22.94 R17.2 | C10.2 R17.2 | R15.1 R18.2 | 10.16,23.1 R18.2 | R18.2 10.43,23.12 11.43,24.13 13.97,24.13 14.97,23.12 R17.2
N$51
  Top 0.406: R49.1 R51.2 99.33,23.12 100.33,24.13 103.14,24.13 R50.2 C27.2
N$52
  Top 0.406: C25.2 R44.2 91.17,23.12 90.17,24.13 87.63,24.13 86.62,23.12 R48.2 R42.1
N$53
  Top 0.406: C23.2 R39.2 78.47,23.12 77.47,24.13 74.93,24.13 73.92,23.12 R41.2 R38.1
N$54
  Top 0.406: C21.2 R35.2 65.78,23.12 64.77,24.13 62.23,24.13 61.23,23.12 R36.2 R31.1
N$55
  Top 0.406: R20.1 R23.2 23.12,23.12 24.13,24.13 26.67,24.13 27.67,23.12 R21.2 C14.2
N$56
  Top 0.406: R24.1 R26.2 35.83,23.12 36.83,24.13 39.37,24.13 40.38,23.12 R25.2 C16.2
N$57
  Top 0.406: C19.2 R29.2 53.07,23.12 52.07,24.13 49.53,24.13 48.52,23.12 R30.2 R27.1
N$59  (via drill 0.4)
  Top 0.406: R44.1 C26.2 91.41,21.33 91.44,21.35 v91.44,19.69
  Bottom 0.406: IC7.7 70.48,36.2 70.48,23.5 71.75,22.23 88.9,22.23 v91.44,19.69
N$60  (via drill 0.4)
  Top 0.406: C15.2 R21.1 v27.94,19.69 | IC7.2 53.98,36.2 46.99,36.2 41.27,30.48 37.46,30.48 36.83,29.85 36.83,27.3 35.56,26.04 v27.94,26.04
  Bottom 0.406: v27.94,19.69 v27.94,26.04
N$62  (via drill 0.4)
  Top 0.406: C17.2 R25.1 v40.64,19.69 | IC7.3 55.24,34.93 47.62,34.93 v43.18,30.48
  Bottom 0.406: v40.64,19.69 43.18,22.23 v43.18,30.48
N$63  (via drill 0.4)
  Top 0.406: C20.2 R29.1 v53.34,19.69
  Bottom 0.406: v53.34,19.69 53.34,21.59 60.96,29.21 IC7.4
N$64  (via drill 0.4)
  Top 0.406: R35.1 C22.2 65.99,21.33 66.04,21.27 v66.04,19.69
  Bottom 0.406: IC7.5 63.5,30.48 65.41,28.58 65.41,20.32 v66.04,19.69
N$65  (via drill 0.4)
  Top 0.406: R50.1 C28.2 104.11,21.33 104.14,21.35 v104.14,19.69
  Bottom 0.406: IC7.8 73.02,36.2 73.02,24.77 74.3,23.5 100.33,23.5 v104.14,19.69
N$66
  Top 0.406: Q5.1 25.18,55.62 R47.2 R43.1
N$67  (via drill 0.4)
  Top 0.406: R39.1 C24.2 78.71,21.33 78.74,21.35 v78.74,19.69
  Bottom 0.406: IC7.6 66.04,30.48 67.95,28.58 67.95,22.23 69.22,20.96 77.47,20.96 v78.74,19.69
N$68
  Top 0.406: Q3.1 25.18,45.45 R45.2 R37.1
N$69
  Top 0.406: Q4.1 25.18,50.54 R46.2 R40.1
N$70  (via drill 0.4)
  Top 0.406: C11.2 R17.1 v15.24,19.69 | IC7.1 52.07,38.1 51.43,37.47 46.35,37.47 40.64,31.75 36.83,31.75 35.56,30.48 35.56,27.94 34.92,27.3 24.77,27.3 20.32,31.75 17.78,31.75 15.24,29.21 v15.24,26.04
  Bottom 0.406: v15.24,19.69 v15.24,26.04
RELAY1  (via drill 0.4)
  Top 0.406: v54.61,40.01 52.78,40.01 52.47,39.69 v39.37,39.69 | 29.58,47.26 R37.2 v29.53,49.05
  Bottom 0.406: IC5.12 67.31,43.81 66.04,42.55 57.15,42.55 v54.61,40.01 J18.6 | v29.53,49.05 29.53,43.18 33.02,39.69 v39.37,39.69
RELAY1LED
  Top 0.406: J8.2 14.61,48.9 14.97,48.52 LED5.C R32.2
RELAY2  (via drill 0.4)
  Top 0.406: v57.15,40.01 55.88,41.27 52.7,41.27 52.07,40.64 40.64,40.64 39.37,41.91 39.37,51.44 38.47,52.34 R40.2 29.9,52.34
  Bottom 0.406: IC5.13 69.85,43.81 67.31,41.27 58.42,41.27 v57.15,40.01 J18.7
RELAY2LED
  Top 0.406: J8.4 14.61,53.98 14.97,53.61 LED6.C R33.2
RELAY3  (via drill 0.4)
  Top 0.406: J18.8 61.59,28.58 62.23,29.21 v62.23,40.01 | v71.12,41.27 72.39,42.55 IC5.14 | v58.42,29.21 v38.1,29.21 | R43.2 29.63,57.41 30.64,58.42 36.83,58.42 37.46,57.79 37.46,55.88 40.64,52.7 v40.64,47.62
  Bottom 0.406: v71.12,41.27 69.85,40.01 v62.23,40.01 60.32,40.01 59.69,39.37 59.69,30.48 v58.42,29.21 | v38.1,29.21 38.1,31.75 40.64,34.29 v40.64,47.62
RELAY3LED
  Top 0.406: J8.6 14.61,59.05 14.97,58.69 LED7.C R34.2
RELAY_VOLTAGE  (via drill 0.4)
  Top 0.406: 17.41,41.3 SJ1.2 v17.38,43.02 | LED5.A 14.97,46.73 14.61,46.36 J8.1 | LED6.A 14.97,51.8 14.61,51.44 J8.3 | LED7.A 14.97,56.88 14.61,56.52 J8.5 10.79,58.42 10.79,59.69 12.07,60.96 18.73,60.96 20.76,58.94 D4.1 | D2.1 v20.95,50.16 | v22.54,53.98 21.91,53.98 21.75,53.82 20.99,53.82 D3.1
  Bottom 0.203: 9.68,57.79 8.1,57.79
  Bottom 0.406: J8.1 14.05,46.36 v17.38,43.02 | v22.54,53.98 20.95,52.39 v20.95,50.16 17.14,46.36 J8.1 | J8.3 10.79,53.34 10.79,54.61 J8.5 11.43,57.79 9.68,57.79 | J8.1 10.79,44.45 6.99,44.45 J14.1 3.17,48.26 3.17,49.53 J14.3 3.17,53.34 3.17,54.61 J14.5 6.35,57.79 8.1,57.79
RXD  (via drill 0.4)
  Top 0.406: J5.6 J5.5 95.25,78.11 98.01,78.11 IC4.2 96.97,72.39 97,72.39 95.25,70.64 v86.36,70.64 R10.2
  Bottom 0.406: J18.0_RX 39.37,31.12 41.91,33.66 IC5.2 46.04,60.64 78.74,60.64 86.36,68.26 v86.36,70.64
SCK  (via drill 0.4)
  Top 0.406: IC7.13 60.96,42.55 59.69,41.27 59.69,36.83 60.96,35.56 60.96,29.21 60.32,28.58 60.32,26.04 61.44,24.92 73.26,24.92 74.3,25.96 J18.13 | v60.96,58.42 62.23,59.69 IC5.19
  Bottom 0.406: IC5.19 62.23,68.58 61.59,69.22 56.52,69.22 55.88,69.85 55.88,76.2 57.78,78.11 J3.3 | IC7.13 v60.96,58.42
SCL
  Top 0.406: IC5.28 39.37,62.23 40,61.59 42.55,61.59 43.18,62.23 IC1.6 43.18,69.22 42.55,69.85 41.27,69.85 40,71.12 R1.1
  Bottom 0.406: J18.A_5 IC5.28
SDA
  Top 0.406: IC5.27 IC1.5 41.83,67.31 41.12,67.31 39.85,68.58 R2.1
  Bottom 0.406: J18.A_4 IC5.27
SIN  (via drill 0.4)
  Top 0.406: R14.1 79.75,71.49 80.01,71.75 | R13.1 80.27,71.49 80.01,71.75 | 80.01,71.75 80.01,74.3 v79.38,74.93
  Bottom 0.406: v79.38,74.93 79.38,78.74 ROUTER.13
SOUT  (via drill 0.4)
  Top 0.305: ROUTER.14 82.55,84.45 101.6,84.45 102.23,83.82 v102.23,78.11
  Top 0.406: R10.1 86.36,66.67 87,66.04 89.53,66.04 90.8,67.31 v93.98,67.31
  Bottom 0.406: v102.23,78.11 104.14,76.2 104.14,74.3 103.5,73.66 94.61,73.66 93.98,73.03 v93.98,67.31
SPARE
  Bottom 0.406: IC5.4 46.99,46.99 44.45,44.45 J18.2
SPARE2
  Bottom 0.406: IC5.6 52.07,40.88 49.53,38.34 J18.4
STATUS_LED  (via drill 0.4)
  Top 0.406: R11.2 13.71,42.81 14.29,42.23 14.29,39.05 15.56,37.78 40.32,37.78 41.27,38.73 v48.26,38.73
  Bottom 0.406: IC5.5 49.53,47.62 50.8,46.36 50.8,41.27 v48.26,38.73 48.26,28.58 J18.3
TXD  (via drill 0.4)
  Top 0.305: 83.85,73.26 R4.1
  Top 0.406: R13.2 R4.1 | v88.27,77.47 J5.3 | v85.57,73.26 83.85,73.26
  Bottom 0.406: J18.1_TX 41.91,31.75 43.18,33.02 43.18,45.09 44.45,46.36 IC5.3 44.53,56.52 48.02,60.01 79.69,60.01 87.95,68.26 87.95,70.88 v85.57,73.26 83.58,73.26 82.55,74.3 82.55,76.2 83.82,77.47 v88.27,77.47 | J5.4 J5.3
V+  (via drill 0.4)
  Top 0.406: IC7.15 53.98,43.81 IC6.2 C13.2 | R38.2 v71.12,19.69 | R15.2 v7.62,19.69 | R42.2 v83.82,19.69 | R20.2 v20.32,19.69 | R24.2 v33.02,19.69 | R27.2 v45.72,19.69 | R31.2 v58.42,19.69 | R49.2 v96.52,19.69
  Bottom 0.406: v7.62,19.69 13.34,19.69 14.61,18.42 15.88,18.42 17.14,19.69 v20.32,19.69 26.03,19.69 27.3,18.42 28.58,18.42 29.84,19.69 v33.02,19.69 38.73,19.69 40,18.42 41.27,18.42 42.55,19.69 v45.72,19.69 | v45.72,19.69 51.43,19.69 52.7,18.42 53.98,18.42 55.24,19.69 v58.42,19.69 64.14,19.69 65.41,18.42 66.67,18.42 67.95,19.69 v71.12,19.69 76.83,19.69 78.11,18.42 79.38,18.42 80.64,19.69 v83.82,19.69 | v96.52,19.69 93.34,19.69 92.08,18.42 90.8,18.42 89.53,19.69 v83.82,19.69 | 81.91,19.69 v83.82,19.69 | IC6.2 46.99,43.81 45.72,42.55 v45.72,19.69

### Text on the board
tPlace: 12V IN | smartenergygroups.com | DTR | TXD | RXD | +5V | GND | +5V | GND | GND | GP1 | GP3 | GND | RXD | LED | FTDI | BLACK | SEGmeter v2.5 | Reset | 1 | 1 | GP2 | GP4 | GND | TXD | 12V | A5 | A4 | A3 | A2 | A1 | A0 | +12V | GND | GND | +5V | +3V | !RST | BYPASS | 5V REG | XBEE MODULE | Relays | Buttons | LEDs | - | 3 | MICRO-SD CARD | 3 | + | - | 2 | 3 | 2 | + | - | 1 | GND/ | 1 | 2 | AGND | + | (7-12V DC 500mA-1A) | 1 | 12V | Relay | 5V | Voltage | CR1220 3V Coin Cell | Hardware design by Luke Weston, 2012 | Open Hardware | +5V | Released under the CERN OH License: | http://ohwr.org/cernohl | DATA | D0 | D1 | D2 | D3 | D4 | D5 | D6 | D7 | D8 | D9 | D10 | D11 | D12 | D13 | GND | REF | GND | Sensors | 5V | 1 | 2 | 3 | 4 | 5 | 6 | 7 | 8
bPlace: SmartEnergyGroups.com | email sam@smartenergygroups.com | on up to our internets website or | some more about this device, roll | save electrons everywhere. If you would like to know | love by @lukeweston and @samotage to help everybody | This fine Internet of Things device was crafted with